# Altium schematic sheet LHR Encoder Board.SchDoc
size A
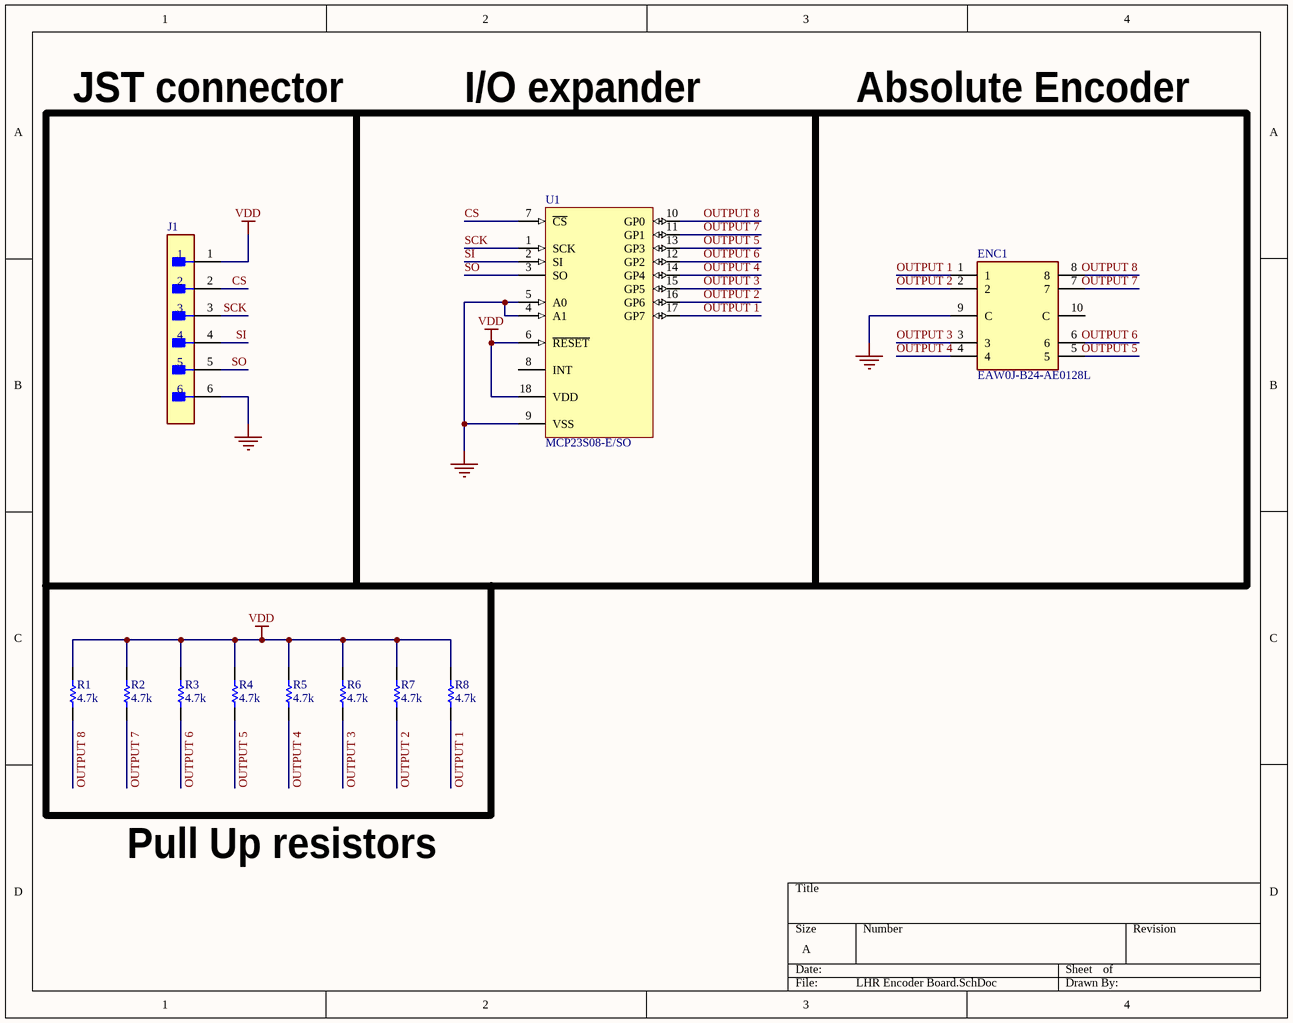
[diagram p0: LHR Encoder Board.SchDoc]

## Parts
ENC1  EAW0J-B24-AE0128L  [FP-EAW0J-B24-AE0128L-MFG]
J1  S6B-XH-A (LF)(SN)  [FP-S6B-XH-A_LF_SN-MFG]  (value not drawn)
R1  4.7k  [RESC1608X55X30NL15T15]
R2  4.7k  [RESC1608X55X30NL15T15]
R3  4.7k  [RESC1608X55X30NL15T15]
R4  4.7k  [RESC1608X55X30NL15T15]
R5  4.7k  [RESC1608X55X30NL15T15]
R6  4.7k  [RESC1608X55X30NL15T15]
R7  4.7k  [RESC1608X55X30NL15T15]
R8  4.7k  [RESC1608X55X30NL15T15]
U1  MCP23S08-E/SO  [SOIC-SO18_N]

## Nets
GND: ENC1.9(C) J1.6 U1.4(A1) U1.5(A0) U1.9(VSS)
VDD: J1.1 R1.2 R2.2 R3.2 R4.2 R5.2 R6.2 R7.2 R8.2 U1.6(~{RESET}) U1.18(VDD)
CS: J1.2 U1.7(~{CS})
OUTPUT 1: ENC1.1 R8.1 U1.17(GP7)
OUTPUT 2: ENC1.2 R7.1 U1.16(GP6)
OUTPUT 3: ENC1.3 R6.1 U1.15(GP5)
OUTPUT 4: ENC1.4 R5.1 U1.14(GP4)
OUTPUT 5: ENC1.5 R4.1 U1.13(GP3)
OUTPUT 6: ENC1.6 R3.1 U1.12(GP2)
OUTPUT 7: ENC1.7 R2.1 U1.11(GP1)
OUTPUT 8: ENC1.8 R1.1 U1.10(GP0)
SCK: J1.3 U1.1(SCK)
SI: J1.4 U1.2(SI)
SO: J1.5 U1.3(SO)

Not connected (* = marked no-connect by the designer): ENC1 10(C); U1 8(INT)

## Notes on the sheet
- JST connector
- I/O expander
- Absolute Encoder
- Pull Up resistors

## Library data of the parts
ENC1 = CMP-07421-000029-1: ROTARY ENCODER MECHANICAL 128PPR; Pulses per Revolution: 128; Built in Switch: No; Insulation Resistance: 1GR; Number of Channels: 8; Hole Diameter: 9mm; Resolution: 8b; Contact Current Rating: 10mA; Nominal Supply Voltage (DC): 10V; Output Type: Binary; Mechanical Life: 50000Cycles; Termination: PC Pins; Packaging: Tray; Orientation: Vertical; Number of Pins: 128; Mount: Through Hole; Radiation Hardening: No; Package Quantity: 45; Primary Type: ENCODER; REACH SVHC: No SVHC; Length: 23.88mm; Type: Mechanical; Encoder Type: Mechanical; Height: 27.56mm; Series: ACE™; Detent: No; Max Operating Temperature: 85°C; Depth: 27.94mm; Min Operating Temperature: -40°C; Weight: 0.5oz
J1 = CMP-17439-000165-2: CONN HEADER R/A 6POS 2.5MM; Number of Contacts: 6; Contact Resistance: 20mR; Max Current Rating: 3A; Max Voltage Rating (AC): 250V; Gender: Male; Insulation Resistance: 1GR; Wire/Cable Gauge: 22AWG; Fastening Type: Detent; Lead Pitch: 2.5mm; Flammability Rating: UL94 V-0; Contact Finish - Mating: TIN; Housing Material: Polyamide; Length: 17.4mm; Termination: Solder; Contact Type: Male Pin; Number of Positions: 6; Mount: Through Hole; Orientation: Right Angle; Voltage Rating (AC): 250V; Contact Shape: Square; Lead Free: Lead Free; Insulation Material: Nylon; Insulation Color: Natural; Contact Plating: Tin; Connector Type: Header; Housing Color: White; Color: Natural; Package Quantity: 500; Contact Material: Brass; Packaging: Bulk; Pitch: 2.5mm; Series: XH; Number of Rows: 1; Min Operating Temperature: -25°C; Voltage Rating: 250V; REACH SVHC: No SVHC; Current Rating: 3A; Depth: 11.5mm; Max Operating Temperature: 85°C
R1-R8 = CMP-1012-00586-3: Precision Thick Film Chip Resistor, 4.7 KOhm, +/- 1%, -55 to 155 degC, 0603 (1608 Metric), RoHS, Tape and Reel; Voltage Rating: 50 V; Elements: 4; Case\Package: 1205; Tolerance: 5%; Power Rating: 250 mW; Resistance: 4.7k; PackageReference: 0603; Max Operating Temperature: 125 degC; REACH SVHC: No SVHC; Width: 0.063 inch; Length: 0.126 inch; Height: 0.024 inch; Mount: Surface Mount; Package Quantity: 1; DatasheetVersion: Apr-15; ComponentLink1Description: Manufacturer URL; Min Operating Temperature: -55 degC; Packaging: Tape and Reel; Radiation Hardening: No; ComponentLink2URL: http://industrial.panasonic.com/cdbs/www-data/pdf/RDA0000/AOA0000C86.pdf; Case Code (Metric): 3216; Pins: 8; Case Code (Imperial): 1206; Type (Resistor): Thick Film; RoHSCompliant: true; ComponentLink2Description: Datasheet; PackageDescription: 2-Pin Surface Mount Device, Body 1.6 x 0.85 mm; ComponentLink1URL: http://www.panasonic.com/
U1 = CMP-0186-00124-2: 8-Bit I/O Expander with Serial Interface, 18-Pin SOIC, Extended Temperature; ComponentLink3URL: http://www.microchip.com/stellent/groups/techpub_sg/documents/packagingspec/en012702.pdf; ComponentLink3Description: Package Specification; PackageDescription: 18-Lead Plastic Small Outline (SO) - Wide 7.50mm Body [SOIC]; Code_JEDEC: MS-013; ComponentLink2Description: Datasheet; PackageVersion: revBB, Aug-2009; RevisionNote: URLs added. Sch pin type corrected.; PackageReference: SOIC-SO18; DatasheetVersion: revE, Aug-2007; ComponentLink1Description: Manufacturer URL; ComponentLink2URL: http://ww1.microchip.com/downloads/en/DeviceDoc/21919e.pdf; ComponentLink1URL: http://www.microchip.com/